# EAGLE design LightSensitiveDCPower (EAGLE 7.2.0)
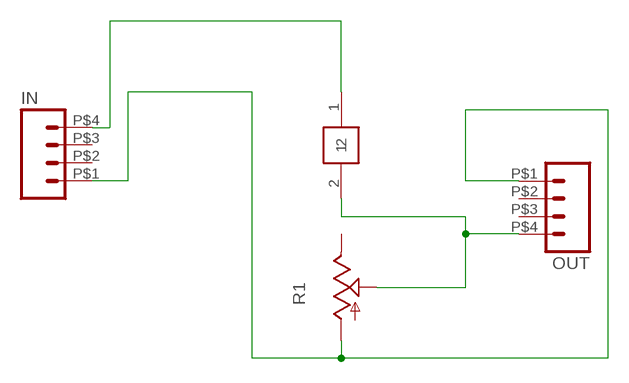
[diagram p0: schematic, sheet 1]

## Parts
IN  M04HORIZ_PTH  [SULLIN-1X4_HORIZ]
OUT  M04HORIZ_PTH  [SULLIN-1X4_HORIZ]
PC1  PDV-P8101  [PHOTOCELL_CERAMIC]
R1  TRIM_US-B25P  [B25P]

## Nets
N$1: IN.P$1 OUT.P$1 R1.A
N$2: IN.P$4 PC1.1
N$4: OUT.P$4 PC1.2 R1.S
Unconnected: IN.P$2 IN.P$3 OUT.P$2 OUT.P$3 R1.E

## Library data of the parts
IN OUT = SparkFun-Connectors:M04: Header 4 Standard 4-pin 0.1" header. Use with straight break away headers (SKU : PRT-00116), right angle break away headers (PRT-00553), swiss pins (PRT-00743), machine pins (PRT-00117), and female headers (PRT-00115). Molex polarized connector foot print use with SKU : PRT-08231 with associated crimp pins and housings. 1MM SMD Version SKU: PRT-10208
PC1 = freddyLibr:PDV-P8101: Photocell in ceramic package
R1 = pot:TRIM_US-: POTENTIOMETER

## Board
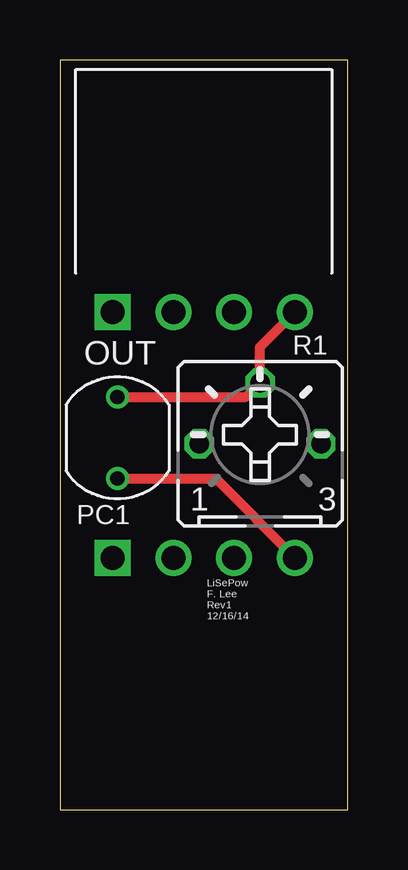
[diagram p1: board, top side]
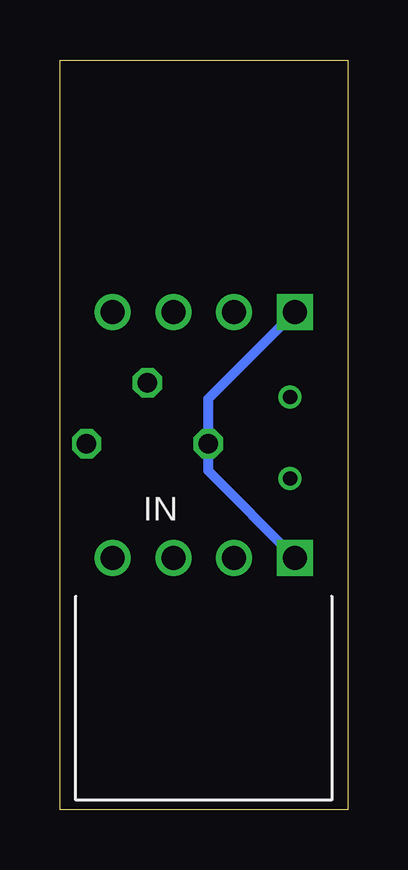
[diagram p2: board, bottom side, seen from below]

Size 12 x 31.26 mm. Coordinates in mm from the lower left corner, seen from the top.
Outline: 0,0 12,0.01 12,31.26 0,31.26 0,0
Copper layers (1*16): Top 0.0356mm / dielectric 1.5011mm / Bottom 0.0356mm
Design rules "LaenPCBOrder": minimum track width 6mil, minimum drill 13mil, track to track 6mil, track to pad 6mil, pad to pad 6mil, via to via 6mil, smd to smd 6mil, copper to edge 15mil, drill to drill 6mil, minimum pad ring 7mil, minimum via ring 7mil, stop-mask expansion 3mil, vias tented up to drill 0mil, thermal gap 10mil

### Footprints (pad centres in the part's own frame; a part is rotated, then mirrored left to right if it is on the bottom)
SULLIN-1X4_HORIZ = drill 1 square: P$1 -3.81,0 | drill 1: P$2 -1.27,0; P$3 1.27,0; P$4 3.81,0
PHOTOCELL_CERAMIC = drill 0.6: 1 0,1.7; 2 0,-1.7
B25P = drill 0.813 octagon: A -2.54,0; E 2.54,0; S 0,2.54

### Placement (x,y rotation side)
IN  6,10.51 180 bottom
OUT  6,20.76 0 top
PC1  2.4,15.51 180 top
R1  8.35,15.26 0 top

### Tracks (layer width: path | path; a pad name or v marks a point on that pad's centre or on a via)
N$1
  Bottom 0.406: IN.P$1 5.81,14.13 R1.A 5.81,17.14 OUT.P$1
N$2
  Top 0.406: PC1.1 6.51,13.81 IN.P$4
N$4
  Top 0.406: OUT.P$4 8.35,19.3 R1.S 7.76,17.21 PC1.2

### Text on the board
tNames: LiSePow / F. Lee / Rev1 / 12/16/14